# EAGLE design JKW_DIP-VGA-v1.0 (EAGLE 7.6.0)
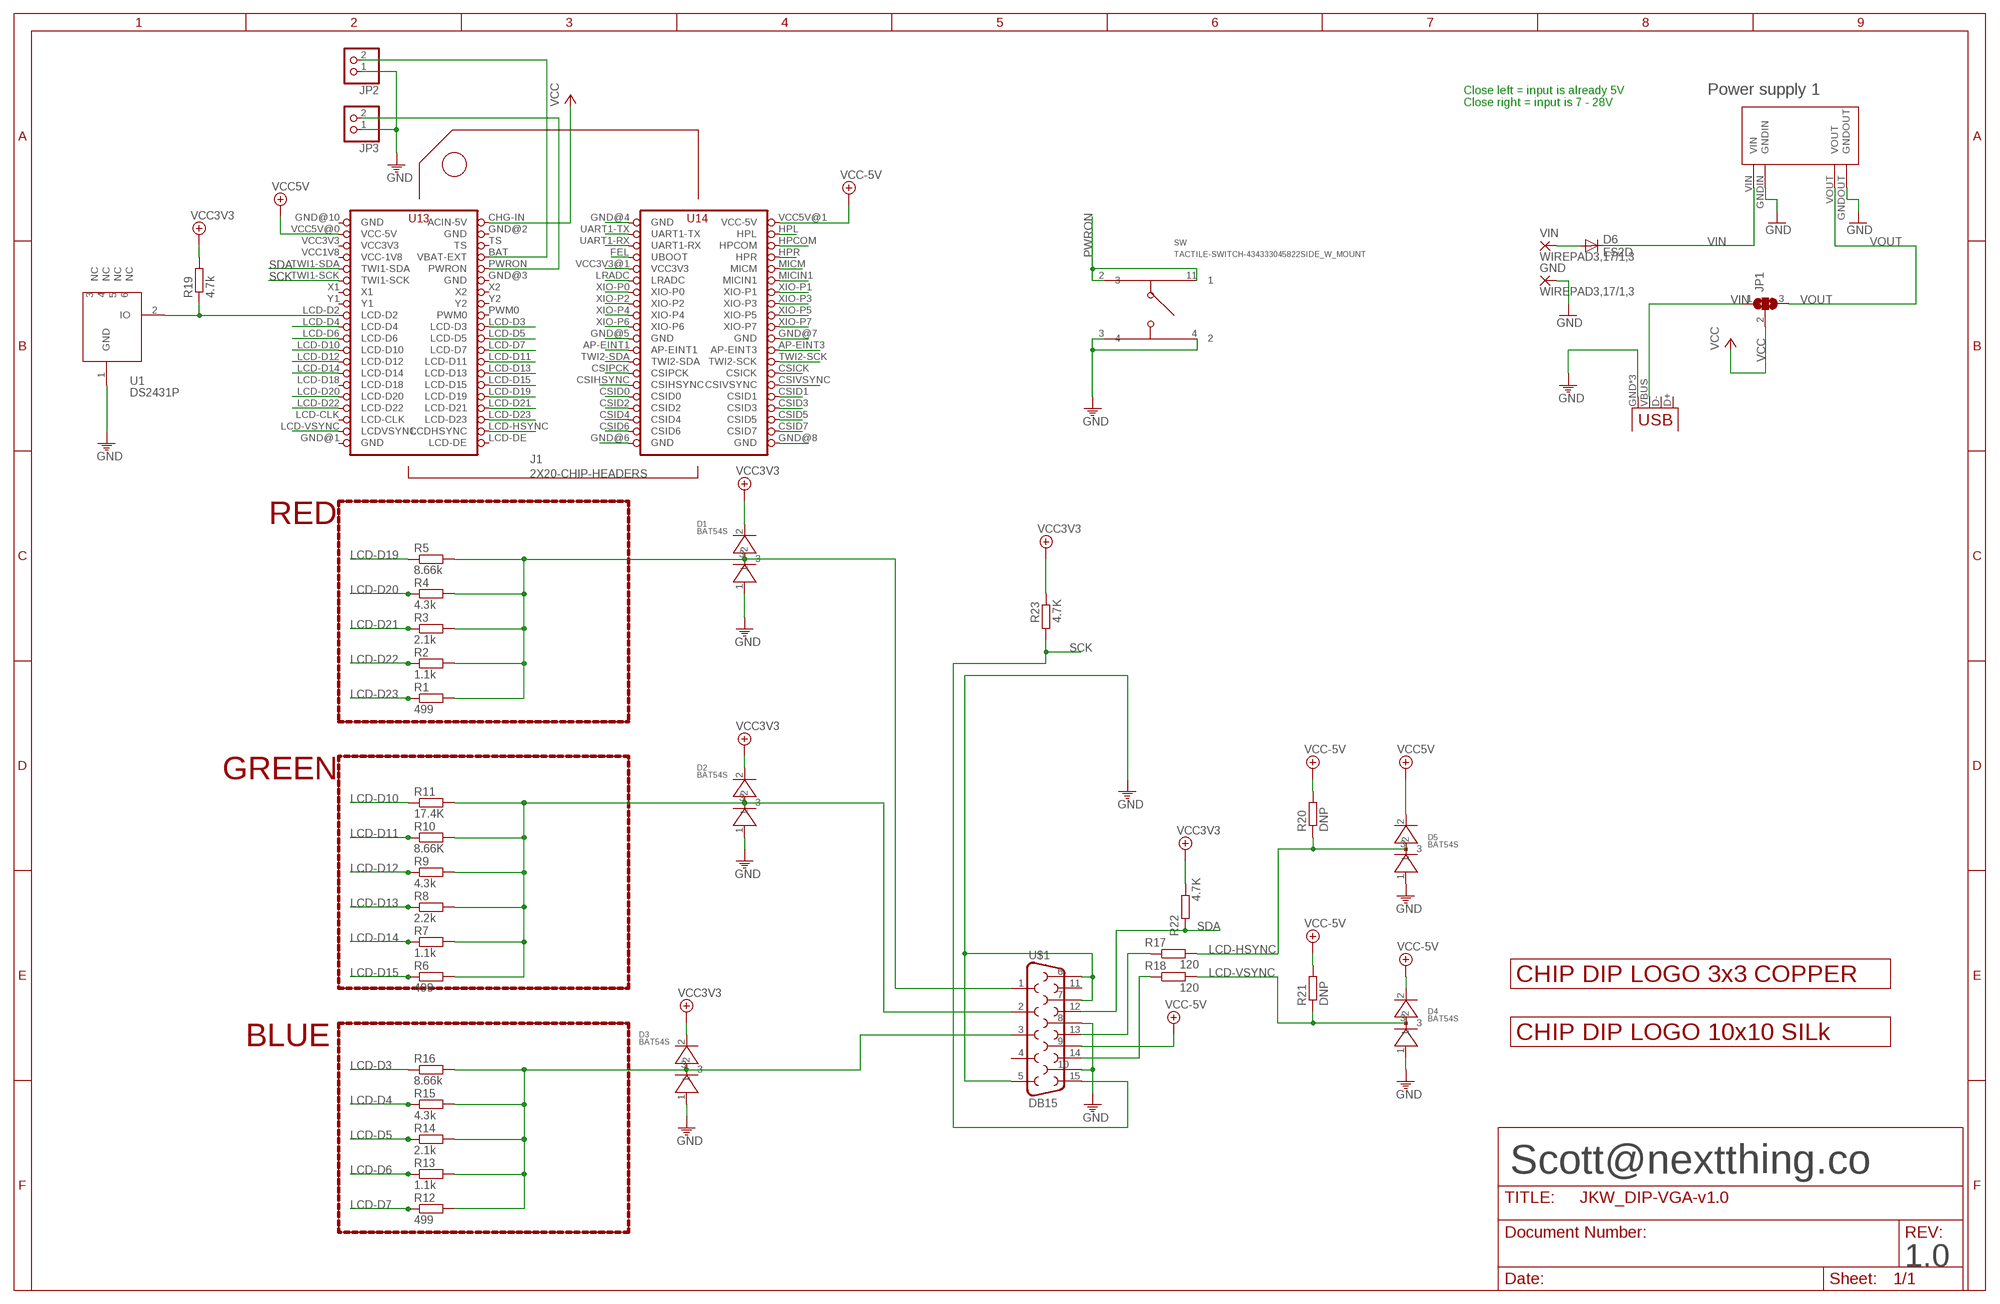
[diagram p0: schematic, sheet 1]

## Parts
D1  BAT54S  [SOT23-BEC]
D2  BAT54S  [SOT23-BEC]
D3  BAT54S  [SOT23-BEC]
D4  BAT54S  [SOT23-BEC]
D5  BAT54S  [SOT23-BEC]
D6  ES2D  [SMB]
GND  WIREPAD3,17/1,3  [3,17/1,3]
J1  2X20-CHIP-HEADERS  [2X20CHIP_SM]
JP1  SJ2W  [SJ_2]
JP2  PINHD-1X2  [1X02]
JP3  PINHD-1X2  [1X02]
R1  499  R-EU_R0805  [R0805]
R2  1.1k  R-EU_R0805  [R0805]
R3  2.1k  R-EU_R0805  [R0805]
R4  4.3k  R-EU_R0805  [R0805]
R5  8.66k  R-EU_R0805  [R0805]
R6  499  R-EU_R0805  [R0805]
R7  1.1k  R-EU_R0805  [R0805]
R8  2.2k  R-EU_R0805  [R0805]
R9  4.3k  R-EU_R0805  [R0805]
R10  8.66K  R-EU_R0805  [R0805]
R11  17.4K  R-EU_R0805  [R0805]
R12  499  R-EU_R0805  [R0805]
R13  1.1k  R-EU_R0805  [R0805]
R14  2.1k  R-EU_R0805  [R0805]
R15  4.3k  R-EU_R0805  [R0805]
R16  8.66k  R-EU_R0805  [R0805]
R17  120  R-EU_R0805  [R0805]
R18  120  R-EU_R0805  [R0805]
R19  4.7k  R-EU_R0805  [R0805]
R20  DNP  R-EU_R0805  [R0805]
R21  DNP  R-EU_R0805  [R0805]
R22  4.7K  R-EU_R0805  [R0805]
R23  4.7K  R-EU_R0805  [R0805]
SW  TACTILE-SWITCH-434333045822SIDE_W_MOUNT  [TACTILE-SWITCH-K2-1114UA-AW]
U1  DS2431P  [TSOC6]
U$1  DB15  [DB15]
U$5  LOGO_3X3_COPPER  [LOGO_3X3_COPPER]
U$6  LOGO_10X10_SILK  [LOGO_10X10_SILK]
U$9  MP1584EN  [MP1584EN]
USB  USBUSB-MICROB-SMT-DIP  [USB-MICROB-SMT-DIP]
VIN  WIREPAD3,17/1,3  [3,17/1,3]

## Nets
1: J1.CSIVSYNC
AP-EINT1: J1.AP-EINT1
AP-EINT3: J1.AP-EINT3
BAT: J1.BAT(VBAT-EXT) JP2.2
CSICK: J1.CSICK
CSID0: J1.CSID0
CSID1: J1.CSID1
CSID2: J1.CSID2
CSID3: J1.CSID3
CSID4: J1.CSID4
CSID5: J1.CSID5
CSID6: J1.CSID6
CSID7: J1.CSID7
CSIHSYNC: J1.CSIHSYNC
CSPICK: J1.CSIPCK
FEL: J1.FEL(UBOOT)
GND: D1.1 D2.1 D3.1 D4.1 D5.1 GND.1(P) J1.GND@4(GND) J1.GND@5(GND) J1.GND@6(GND) J1.GND@7(GND) J1.GND@8(GND) JP2.1 JP3.1 SW.3 SW.4 U1.1(GND) U$1.5 U$1.6 U$1.7 U$1.8 U$1.10 U$9.GNDIN U$9.GNDOUT USB.GND USB.MT1(GND) USB.MT2(GND)
HPCOM: J1.HPCOM
HPL: J1.HPL
HPR: J1.HPR
LCD-D3: J1.LCD-D3 R16.1
LCD-D4: J1.LCD-D4 R15.1
LCD-D5: J1.LCD-D5 R14.1
LCD-D6: J1.LCD-D6 R13.1
LCD-D7: J1.LCD-D7 R12.1
LCD-D10: J1.LCD-D10 R11.1
LCD-D11: J1.LCD-D11 R10.1
LCD-D12: J1.LCD-D12 R9.1
LCD-D13: J1.LCD-D13 R8.1
LCD-D14: J1.LCD-D14 R7.1
LCD-D15: J1.LCD-D15 R6.1
LCD-D19: J1.LCD-D19 R5.1
LCD-D20: J1.LCD-D20 R4.1
LCD-D21: J1.LCD-D21 R3.1
LCD-D22: J1.LCD-D22 R2.1
LCD-D23: J1.LCD-D23 R1.1
LCD-HSYNC: D5.3 J1.LCD-HSYNC(LCDHSYNC) R17.2 R20.1
LCD-VSYNC: D4.3 J1.LCD-VSYNC(LCDVSYNC) R18.2 R21.1
LRADC: J1.LRADC
MICIN1: J1.MICIN1
MICM: J1.MICM
N$1: R17.1 U$1.13
N$2: R18.1 U$1.14
N$3: JP1.1 USB.VBUS
N$5: J1.LCD-D2 R19.1 U1.2(IO)
N$12: D2.3 R6.2 R7.2 R8.2 R9.2 R10.2 R11.2 U$1.2
N$13: D1.3 R1.2 R2.2 R3.2 R4.2 R5.2 U$1.1
N$19: D3.3 R12.2 R13.2 R14.2 R15.2 R16.2 U$1.3
N$65: D6.A VIN.1(P)
PWRON: J1.PWRON JP3.2 SW.2 SW.11
SCK: J1.TWI1-SCK R23.1 U$1.15
SDA: J1.TWI1-SDA R22.1 U$1.12
TWI2-SCK: J1.TWI2-SCK
TWI2-SDA: J1.TWI2-SDA
UART1-RX: J1.UART1-RX
UART1-TX: J1.UART1-TX
VCC: J1.CHG-IN(ACIN-5V) JP1.2
VCC3V3: D1.2 D2.2 D3.2 J1.VCC3V3@1(VCC3V3) R19.2 R22.2 R23.2
VCC5V: D4.2 D5.2 J1.VCC5V@0(VCC-5V) J1.VCC5V@1(VCC-5V) R20.2 R21.2 U$1.9 ; supply symbol labelled VCC-5V
VIN: D6.C U$9.VIN
VOUT: JP1.3 U$9.VOUT
XIO-P0: J1.XIO-P0
XIO-P1: J1.XIO-P1
XIO-P2: J1.XIO-P2
XIO-P3: J1.XIO-P3
XIO-P4: J1.XIO-P4
XIO-P5: J1.XIO-P5
XIO-P6: J1.XIO-P6
XIO-P7: J1.XIO-P7
Unconnected: J1.LCD-CLK J1.LCD-D18 J1.LCD-DE J1.PWM0 J1.TS J1.X1 J1.X2 J1.Y1 J1.Y2 U1.3(NC) U1.4(NC) U1.5(NC) U1.6(NC) U$1.4 U$1.11 USB.D+ USB.D-

## Notes on the sheet
- Power supply 1
- Close left = input is already 5V
  Close right = input is 7 - 28V
- RED
- GREEN
- BLUE
- Scott@nextthing.co
- 1.0

## Power pins joined to a net without a drawn wire
GND: J1.GND@1(GND) J1.GND@2(GND) J1.GND@3(GND) J1.GND@10(GND)
VCC3V3: J1.VCC3V3
VCC-1V8: J1.VCC1V8(VCC-1V8)

## Library data of the parts
D1-D5 = VGA-DIP:BAT54S
D6 = diode:ES2D: DIODE super fast rectifier, 2 A
GND VIN = wirepad:WIREPAD: Wire PAD connect wire on PCB
J1 = VGA-DIP:2X20-CHIP-HEADERS: Through hole layout with chip reference
JP1 = jumper:SJ2W: SMD solder JUMPER
JP2 JP3 = pinhead:PINHD-1X2: PIN HEADER
R1-R23 = rcl:R-EU_: RESISTOR, European symbol
SW = cheeper:TACTILE-SWITCH-434333045822
U1 = VGA-DIP:DS2431: 1024-Bit EEPROM This chip provides a 4x256 Bit EEPROM, which can be programmed@5V. Write protection and OTP emulation are available, too. Author: Jan Kandziora <jjj@gmx.de>; DESCRIPTION: IC, 1024-Bit, 1-Wire EEPROM, TSOC6; FOOTPRINT: TSOC6; LINK: http://www.digikey.com/product-detail/en/DS2431P%2BT%26R/DS2431P%2BT%26RCT-ND/3647900; MFG: DIGIKEY; MFG_PN: DS2431P+T&RCT-ND; PART_TYPE: IC; PRICE: 0.98; VENDOR: MAXIM; VENDOR_PART_NUMBER: DS2431P+T&R
U$1 = SparkFun-Connectors:DB15: DB15 / VGA right angle through-hole female connector.
U$5 = logo:LOGO_3X3_COPPER
U$6 = logo:LOGO_10X10_SILK
U$9 = power_supply:MP1584EN
USB = Spark:USB

## Board
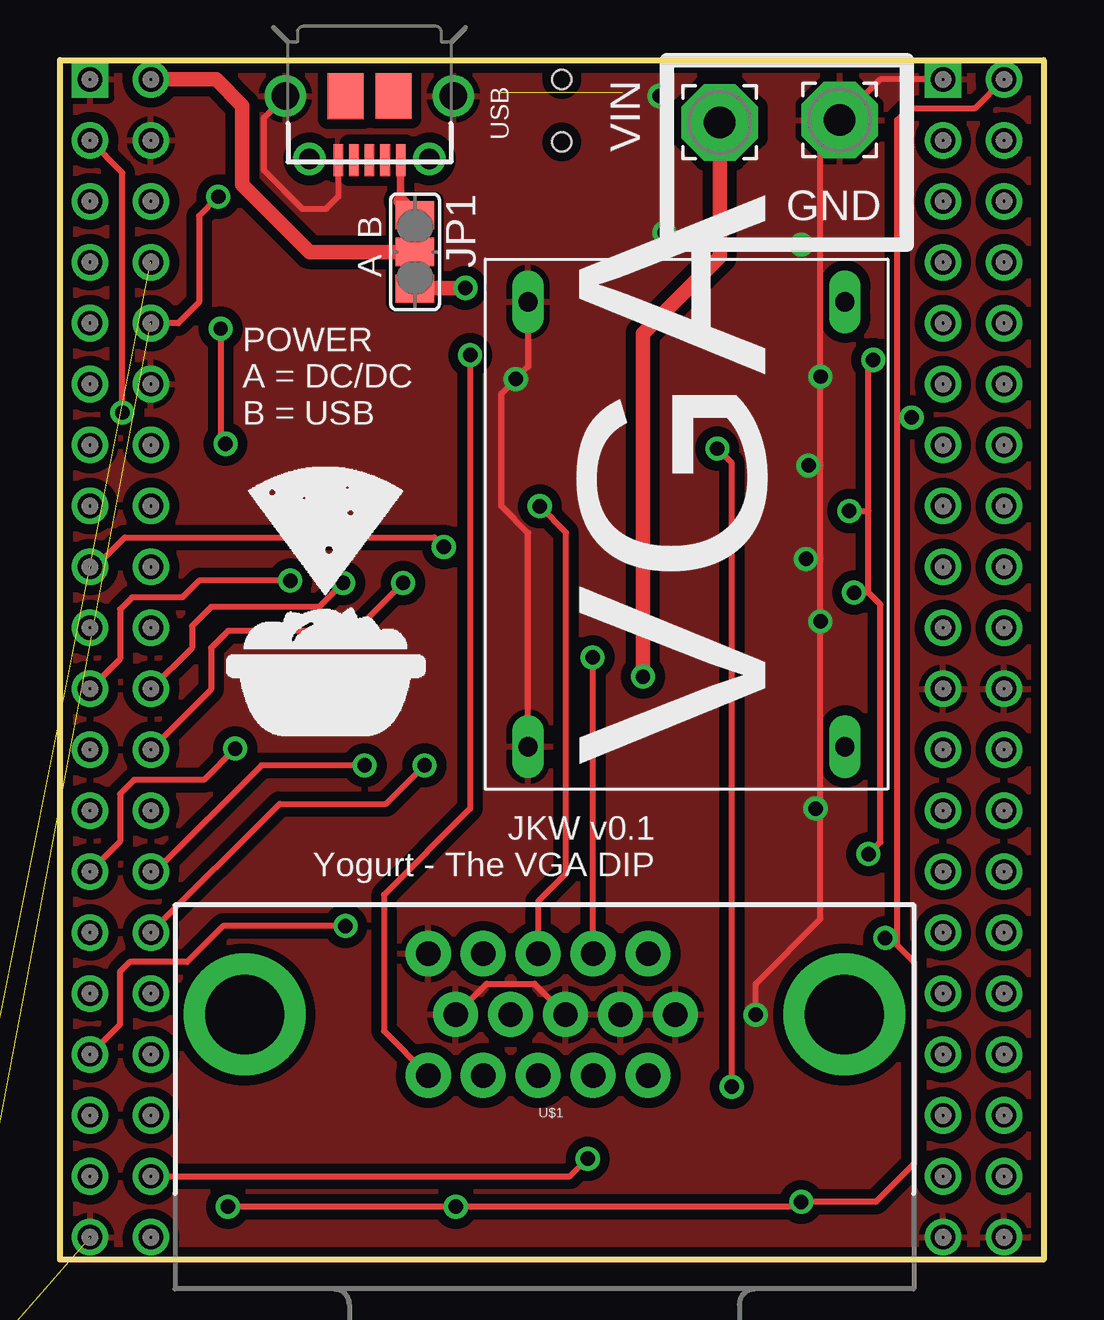
[diagram p1: board, top side]
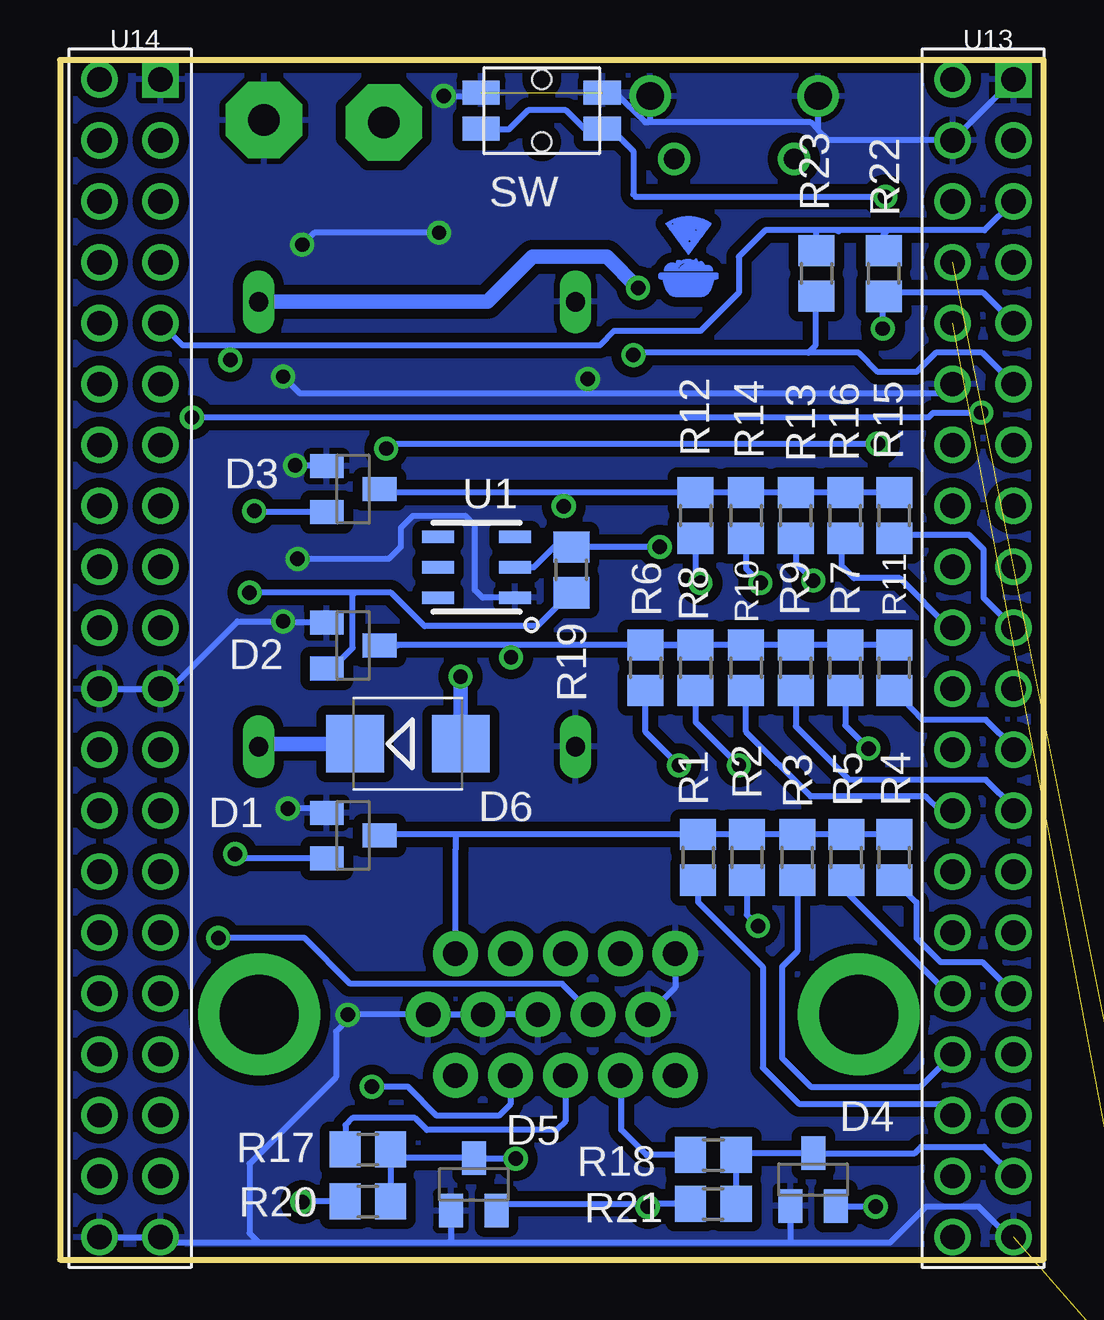
[diagram p2: board, bottom side, seen from below]

Size 41 x 50 mm. Coordinates in mm from the lower left corner, seen from the top.
Outline: 41,0 0,0 0,50 41,50 41,0
Copper layers (1*2*15*16): Top 0.035mm / dielectric 0.2mm / Route2 0.035mm / dielectric 0.2mm / Route15 0.035mm / dielectric 0.2mm / Bottom 0.035mm
Design rules "Hampoo *": minimum track width 3mil, minimum drill 8mil, track to track 3mil, track to pad 3mil, pad to pad 3mil, via to via 3mil, smd to smd 3mil, copper to edge 10mil, drill to drill 8mil, minimum pad ring 10mil, minimum via ring 8mil, stop-mask expansion 4mil, vias tented up to drill 39mil, thermal gap 10mil

### Footprints (pad centres in the part's own frame; a part is rotated, then mirrored left to right if it is on the bottom)
SOT23-BEC = smd 1 x 1.4: 1 -0.95,-1.1; 2 0.95,-1.1; 3 0,1.1
SMB = smd 2.4 x 2.4: A 2.2,0; C -2.2,0
3,17/1,3 = drill 1.321 pad 3.175 octagon: 1 0,0
2X20CHIP_SM = drill 1.016: AP-EINT1 36.81,21.65; AP-EINT3 39.35,21.65; BAT 3.79,41.97; CHG-IN 3.79,49.59; CSICK 39.35,16.57; CSID0 36.81,11.49; CSID1 39.35,11.49; CSID2 36.81,8.95; CSID3 39.35,8.95; CSID4 36.81,6.41; CSID5 39.35,6.41; CSID6 36.81,3.87; CSID7 39.35,3.87; CSIHSYNC 36.81,14.03; CSIPCK 36.81,16.57; CSIVSYNC 39.35,14.03; FEL 36.81,41.97; GND@1 3.79,36.89; GND@2 1.25,1.33; GND@4 39.35,24.19; GND@5 39.35,1.33; GND@6 36.81,1.33; GND@7 36.81,24.19; GND@10 3.79,47.05; HPCOM 39.35,44.51; HPL 39.35,47.05; HPR 39.35,41.97; LCD-CLK 1.25,6.41; LCD-D2 1.25,29.27; LCD-D3 3.79,26.73; LCD-D4 1.25,26.73; LCD-D5 3.79,24.19; LCD-D6 1.25,24.19; LCD-D7 3.79,21.65; LCD-D10 1.25,21.65; LCD-D11 3.79,19.11; LCD-D12 1.25,19.11; LCD-D13 3.79,16.57; LCD-D14 1.25,16.57; LCD-D15 3.79,14.03; LCD-D18 1.25,14.03; LCD-D19 3.79,11.49; LCD-D20 1.25,11.49; LCD-D21 3.79,8.95; LCD-D22 1.25,8.95; LCD-D23 3.79,6.41; LCD-DE 3.79,1.33; LCD-HSYNC 3.79,3.87; LCD-VSYNC 1.25,3.87; LRADC 36.81,36.89; MICIN1 39.35,36.89; MICM 39.35,39.43; PWM0 3.79,29.27; PWRON 3.79,39.43; TS 3.79,44.51; TWI1-SCK 1.25,36.89; TWI1-SDA 1.25,39.43; TWI2-SCK 39.35,19.11; TWI2-SDA 36.81,19.11; UART1-RX 36.81,44.51; UART1-TX 36.81,47.05; VCC1V8 1.25,41.97; VCC3V3 1.25,44.51; VCC3V3@1 36.81,39.43; VCC5V@0 1.25,47.05; VCC5V@1 39.35,49.59; X1 1.25,34.35; X2 3.79,34.35; XIO-P0 36.81,34.35; XIO-P1 39.35,34.35; XIO-P2 36.81,31.81; XIO-P3 39.35,31.81; XIO-P4 36.81,29.27; XIO-P5 39.35,29.27; XIO-P6 36.81,26.73; XIO-P7 39.35,26.73; Y1 1.25,31.81; Y2 3.79,31.81 | drill 1.016 square: GND@3 1.25,49.59; GND@8 36.81,49.59
SJ_2 = smd 1.168 x 1.6: 1 -1.524,0; 2 0,0; 3 1.524,0
1X02 = drill 1.016 long: 1 -1.27,0; 2 1.27,0
R0805 = smd 1.3 x 1.5: 1 -0.95,0; 2 0.95,0
TACTILE-SWITCH-K2-1114UA-AW = smd 1.55 x 1: 2 -2.525,0.75; 3 -2.525,-0.75; 4 2.525,-0.75; 11 2.525,0.75 | hole 0.8: 0,1.3; 0,-1.3
TSOC6 = smd 0.53 x 1.33: 1 -1.27,-1.6; 2 0,-1.6; 3 1.27,-1.6; 4 1.27,1.6; 5 0,1.6; 6 -1.27,1.6
DB15 = drill 1.016 pad 1.88: 1 -4.32,-7.62; 2 -2.03,-7.62; 3 0.26,-7.62; 4 2.55,-7.62; 5 4.84,-7.62; 6 -5.46,-5.08; 7 -3.17,-5.08; 8 -0.88,-5.08; 9 1.41,-5.08; 10 3.7,-5.08; 11 -4.32,-2.54; 12 -2.03,-2.54; 13 0.26,-2.54; 14 2.55,-2.54; 15 4.84,-2.54 | drill 3.302 pad 5.08: G1 -12.5,-5.08; G2 12.5,-5.08
MP1584EN = drill 0.8 long: GNDIN 1.778,14.986; GNDOUT 20.32,14.986; VIN 1.778,1.778; VOUT 20.32,1.778
USB-MICROB-SMT-DIP = smd 0.4 x 1.35: D+ 0,2.675; D- -0.65,2.675; GND 1.3,2.675; ID 0.65,2.675; VBUS -1.3,2.675 | drill 1.15 pad 1.7: MT1 -3.5,0; MT2 3.5,0 | drill 0.85 pad 1.25: MT3 -2.5,2.625; MT4 2.5,2.625 | smd 1.5 x 1.9: P$1 -1,0; P$2 1,0.01

### Placement (x,y rotation side)
D1  28.78,17.68 270 bottom
D2  28.78,25.6 270 bottom
D3  28.78,32.12 270 bottom
D4  9.6,3.33 0 bottom
D5  23.75,3.13 0 bottom
D6  26.5,21.5 0 bottom
GND  32.5,47.5 0 top
J1  0,-0.4 0 top
JP1  14.8,42 270 top
JP2  -8,-11.1 0 top  (outside the outline)
JP3  -8,-16.7 0 top  (outside the outline)
R1  14.4,16.76 90 bottom
R2  12.37,16.76 90 bottom
R3  10.27,16.76 90 bottom
R4  6.22,16.76 90 bottom
R5  8.22,16.76 90 bottom
R6  16.59,24.66 90 bottom
R7  8.27,24.66 90 bottom
R8  14.51,24.66 90 bottom
R9  10.32,24.66 90 bottom
R10  12.4,24.66 90 bottom
R11  6.22,24.66 90 bottom
R12  14.51,31.01 90 bottom
R13  10.32,31.01 90 bottom
R14  12.4,31.01 90 bottom
R15  6.22,31.01 90 bottom
R16  8.27,31.01 90 bottom
R17  28.16,4.59 0 bottom
R18  13.76,4.35 0 bottom
R19  19.69,28.75 270 bottom
R20  28.17,2.42 180 bottom
R21  13.77,2.32 180 bottom
R22  6.67,41.1 90 bottom
R23  9.47,41.1 90 bottom
SW  20.92,47.89 180 bottom
U1  23.63,28.86 90 bottom
U$1  20.19,5.13 180 top
U$5  14.8,41.8 0 bottom
U$6  6.9,21.8 0 top
U$9  34.5,19.6 90 top
USB  12.9,48.5 180 top
VIN  27.5,47.4 0 top

### Tracks (layer width: path | path; a pad name or v marks a point on that pad's centre or on a via)
BAT  (1 unrouted)
GND  (via drill 0.6)  (3 unrouted)
  Top 0.254: U$1.10 17.78,11.5 19.78,11.5 U$1.8 | 31.7,29.2 v31.7,26.6 31.7,19 | 31.7,29.2 31.7,33.1 | 31.7,33.1 v31.7,36.8 31.7,42.3 | v31.2,33.1 31.7,33.1 | v31.5,18.8 31.7,19 | v29,10.2 29,11.5 31.7,14.2 31.7,19 | v31.1,29.2 31.7,29.2 | USB.GND 11.6,44.3 11.1,43.8 10.1,43.8 8.5,45.4 8.5,47.6 USB.MT2 | v30.9,42.3 31.7,42.3 | U$9.GNDIN 19.51,30.29 18.4,31.4 18.4,36.1 v19,36.7 19.51,37.21 U$9.GNDOUT | 31.7,42.3 31.7,46.7 GND.1 34.19,49.19 J1.GND@8 | v25.2,42.8 25.2,48.3 v25,48.5
  Bottom 0.254: U$1.8 U$1.7 U$1.6 28.79,10.21 28.8,10.2 | J1.GND@5 J1.GND@6 36.58,0.7 32.7,0.7 | J1.GND@2 1.43,0.93 2.7,2.2 4.9,2.2 6.4,0.7 10.6,0.7 | 10.6,0.7 24.8,0.7 | 24.8,0.7 32.7,0.7 | D4.1 10.55,0.75 10.6,0.7 | D5.1 24.7,0.8 24.8,0.7 | 28.8,10.2 29.5,9.5 29.5,7.6 33.1,4 33.1,1.1 32.7,0.7 | U$1.5 15.35,11.35 U$1.10 | D2.1 31.64,26.55 v31.7,26.6 33.6,26.6 36.41,23.79 J1.GND@7 J1.GND@4 | D3.1 29.91,33.1 v31.2,33.1 | D1.1 30.05,18.8 v31.5,18.8 | 28.8,10.2 v29,10.2 | J1.GND@3 J1.GND@10 8.95,46.65 9.4,47.1 | J1.GND@1 4.18,36.1 19,36.1 | 19,36.1 31,36.1 v31.7,36.8 | U1.1 23.39,27.59 23.7,27.9 23.7,30.6 24.1,31 26.3,31 26.8,30.5 26.8,29.7 27.3,29.2 v31.1,29.2 | 9.4,47.1 9.7,47.4 16.5,47.4 | USB.MT2 9.4,47.1 | USB.MT1 16.4,47.5 16.5,47.4 | 16.5,47.4 16.6,47.4 17.84,48.64 SW.3 | v19,36.7 19,36.1 | v25,48.5 23.58,48.5 SW.4 | v25.2,42.8 30.4,42.8 v30.9,42.3
  pour Top (isolate 0.406): 0,0 41,0 41,50 0,50
  pour Bottom (isolate 0.406): 0,0 41,0 41,50 0,50
LCD-D3
  Bottom 0.254: J1.LCD-D3 3.93,26.33 6,28.4 7.9,28.4 8.4,28.9 8.4,30.04 R16.1
LCD-D4
  Bottom 0.254: J1.LCD-D4 2.5,27.58 2.5,29.6 3.1,30.2 6.25,30.2 R15.1
LCD-D5  (via drill 0.6)
  Top 0.254: v11.8,28.2 10.8,27.2 6.3,27.2 5.5,26.4 5.5,25.5 J1.LCD-D5
  Bottom 0.254: R14.1 12.4,28.8 v11.8,28.2
LCD-D6  (via drill 0.6)
  Top 0.254: v9.6,28.3 5.8,28.3 5.1,27.6 3,27.6 2.5,27.1 2.5,25.04 J1.LCD-D6
  Bottom 0.254: R13.1 10.32,29.03 v9.6,28.3
LCD-D7  (via drill 0.6)
  Top 0.254: v14.3,28.2 12.3,26.2 7,26.2 6.3,25.5 6.3,23.76 J1.LCD-D7
  Bottom 0.254: R12.1 14.51,28.41 v14.3,28.2
LCD-D10
  Bottom 0.254: J1.LCD-D10 1.25,21.35 2.4,22.5 5.05,22.5 R11.1
LCD-D11
  Bottom 0.254: J1.LCD-D11 4.31,18.71 4.9,19.3 9.7,19.3 12.4,22 R10.1
LCD-D12
  Bottom 0.254: J1.LCD-D12 1.25,18.85 2.4,20 8.1,20 10.1,22 10.2,22.1 10.32,22.23 R9.1
LCD-D13  (via drill 0.6)
  Top 0.254: v12.7,20.6 8.4,20.6 3.97,16.17 J1.LCD-D13
  Bottom 0.254: R8.1 14.51,22.41 v12.7,20.6
LCD-D14  (via drill 0.6)
  Top 0.254: v7.3,21.3 6,20 3.1,20 2.5,19.4 2.5,17.42 J1.LCD-D14
  Bottom 0.254: R7.1 8.27,22.27 v7.3,21.3
LCD-D15  (via drill 0.6)
  Top 0.254: J1.LCD-D15 9.16,19 13.6,19 v15.2,20.6
  Bottom 0.254: v15.2,20.6 16.59,21.99 R6.1
LCD-D19
  Bottom 0.254: J1.LCD-D19 3.99,11.09 8.22,15.32 R5.1
LCD-D20
  Bottom 0.254: R4.1 5.3,14.89 5.3,13.4 4.3,12.4 2.56,12.4 J1.LCD-D20
LCD-D21
  Bottom 0.254: R3.1 10.27,12.83 10.9,12.2 10.9,8.4 9.7,7.2 5.14,7.2 J1.LCD-D21
LCD-D22  (via drill 0.6)
  Top 0.254: v11.9,13.9 6.8,13.9 5.3,12.4 2.9,12.4 2.65,12.15 2.6,12.1 2.5,12 2.5,9.8 J1.LCD-D22
  Bottom 0.254: R2.1 12.37,14.37 v11.9,13.9
LCD-D23
  Bottom 0.254: R1.1 14.4,14.9 11.7,12.2 11.7,8 10.2,6.5 4.28,6.5 J1.LCD-D23
LCD-HSYNC  (via drill 0.6)
  Top 0.254: J1.LCD-HSYNC 21.27,3.47 v22,4.2
  Bottom 0.254: R20.1 R17.2 26.86,4.23 D5.3 23.71,4.2 v22,4.2
LCD-VSYNC
  Bottom 0.254: J1.LCD-VSYNC 2.48,4.7 5.1,4.7 5.37,4.43 D4.3 12.73,4.43 R18.2 R21.1
N$1
  Bottom 0.254: U$1.13 19.93,5.77 20.3,5.4 25.7,5.4 26.2,5.9 28.8,5.9 29.1,5.6 29.1,4.6 R17.1
N$2
  Bottom 0.254: R18.1 16.55,4.35 17.6,5.4 17.6,7.63 U$1.14
N$3
  Top 0.305: USB.VBUS 14.2,44.12
  Top 0.61: 14.2,44.12 JP1.1
N$5  (via drill 0.6)
  Top 0.254: J1.LCD-D2 1.47,28.87 2.7,30.1 15.6,30.1 v16,29.7
  Bottom 0.254: U1.2 21.25,28.86 20.4,29.7 R19.1 v16,29.7
N$12  (via drill 0.6)
  Top 0.254: v22.2,25.1 22.22,25.08 U$1.2
  Bottom 0.254: R11.2 R7.2 R9.2 R10.2 R6.2 R8.2 22.2,25.61 | 22.2,25.61 26.9,25.61 | 26.9,25.61 26.99,25.61 27,25.6 | D2.3 26.92,25.6 26.9,25.61 | v22.2,25.1 22.2,25.61
N$13
  Bottom 0.254: R4.2 R5.2 R3.2 R2.2 R1.2 24.5,17.71 | 24.5,17.71 27.59,17.71 27.62,17.68 D1.3 | 24.5,17.71 24.5,17.1 24.51,17.09 U$1.1
N$19  (via drill 0.6)
  Top 0.254: 19.93,31.33 v20,31.4 21.1,30.3 21.1,16.1 19.93,14.93 U$1.3
  Bottom 0.254: R16.2 R13.2 R14.2 R12.2 20,31.96 | 20,31.96 27.53,31.96 D3.3 | R15.2 R16.2 | R16.2 8.27,31.94 8.3,31.9 | v20,31.4 20,31.96
N$65  (via drill 0.6)
  Top 0.61: v24.3,24.3 24.3,38.6 27.5,41.8 VIN.1
  Bottom 0.61: D6.A v24.3,24.3
PWRON  (via drill 0.6)  (1 unrouted)
  Top 0.254: v6.6,44.3 5.8,43.5 5.8,39.9 4.93,39.03 J1.PWRON
  Bottom 0.254: v6.6,44.3 17,44.3 17.1,44.4 17.1,46.2 18.04,47.14 SW.2 19.14,47.14 19.9,47.9 21.5,47.9 22.3,47.1 23.41,47.1 SW.11
SCK  (via drill 0.6)
  Top 0.254: v17.1,37.7 17.1,18.8 13.5,15.2 13.5,9.52 U$1.15
  Bottom 0.254: J1.TWI1-SCK 2.56,37.8 4.5,37.8 5.3,37 6.9,37 7.7,37.8 9.8,37.8 | 9.5,40.12 R23.1 9.52,40.2 9.52,38.09 9.8,37.8 | 9.8,37.8 17,37.8 v17.1,37.7
SDA  (via drill 0.6)
  Top 0.254: v28,7.2 28,33.2 v27.4,33.8 | v6.7,38.8 6.7,34.2 arc90 v6.9,34
  Bottom 0.254: J1.TWI1-SDA 2.52,40.3 6.61,40.3 R22.1 6.7,40.11 v6.7,38.8 | U$1.12 22.22,6.48 22.7,6 25.3,6 26.5,7.2 v28,7.2 | v6.9,34 27.2,34 arc-90 v27.4,33.8
VCC
  Top 0.61: J1.CHG-IN 6.51,49.19 7.6,48.1 7.6,44.8 10.4,42 JP1.2
VCC3V3  (via drill 0.6)
  Top 0.254: 33.7,27.8 33.7,31.2 | v32.9,31.2 33.7,31.2 | v33.1,27.8 33.7,27.8 | 33.7,27.8 34.2,27.3 34.2,17.4 v33.7,16.9 | 33.7,31.2 33.7,37.3 v33.9,37.5
  Bottom 0.254: J1.VCC3V3 2.46,42.9 6.5,42.9 | 6.5,42.9 8.6,42.9 | 8.6,42.9 9.5,42.9 | 8.55,42.85 8.6,42.9 | R22.2 6.67,42.73 6.5,42.9 | R23.2 9.47,42.87 9.5,42.9 | D1.2 33.52,16.73 v33.7,16.9 | 36.74,39.1 J1.VCC3V3@1 35.88,38.1 33.9,38.1 | D3.2 32.87,31.17 v32.9,31.2 | 9.5,42.9 11.6,42.9 12.7,41.8 12.7,40.3 14.3,38.7 17.9,38.7 18.5,38.1 33.9,38.1 | R19.2 19.7,27.8 21.1,26.4 25.8,26.4 27.2,27.8 28.7,27.8 | 28.7,27.8 v33.1,27.8 | D2.2 29.66,24.65 28.8,25.5 28.8,27.7 28.7,27.8 | v33.9,37.5 33.9,38.1
VCC5V  (via drill 0.6)
  Top 0.254: 34.9,13.4 34.9,13.1 35.6,12.4 35.6,4 34,2.4 v30.9,2.4 30.7,2.2 v16.5,2.2 v7,2.2 | 34.9,13.4 34.9,35.1 | 34.9,35.1 34.9,47.5 35.4,48 38.16,48 J1.VCC5V@1 | v34.4,13.4 34.9,13.4 | v35.5,35.1 34.9,35.1 | v2.6,35.3 2.6,45.3 J1.VCC5V@0
  Bottom 0.254: U$1.9 20.07,11.5 28.9,11.5 30.8,13.4 v34.4,13.4 | R20.2 30.88,2.42 v30.9,2.4 | v35.5,35.1 4.8,35.1 4.6,35.3 v2.6,35.3 | D5.2 22.87,2.03 | 22.87,2.03 22.9,2 | v7,2.2 8.62,2.2 D4.2 | R21.2 16.38,2.32 | 16.38,2.32 v16.5,2.2 | 22.87,2.03 22.58,2.32 16.38,2.32
VIN
  Bottom 0.61: D6.C 32.6,21.5 arc-90 U$9.VIN
VOUT  (via drill 0.6)
  Top 0.61: v16.9,40.5 14.82,40.5 JP1.3
  Bottom 0.61: U$9.VOUT 23.18,39.92 21.3,41.8 18.2,41.8 v16.9,40.5

### Text on the board
tNames: B | A | POWER / A = DC/DC / B = USB | VGA | JKW v0.1 / Yogurt - The VGA DIP